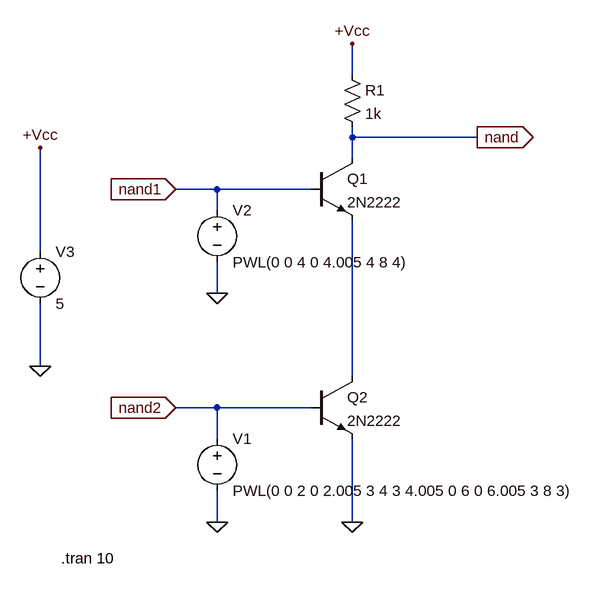
[diagram p0: schematic NAND gate.asc]
NAND gate.asc, the LTspice schematic file:
Version 4
SHEET 1 2492 680
WIRE 416 -176 416 -224
WIRE 416 -80 416 -96
WIRE 608 -80 416 -80
WIRE 416 -48 416 -80
WIRE 208 0 144 0
WIRE 352 0 208 0
WIRE 208 32 208 0
WIRE -64 96 -64 -64
WIRE 208 160 208 112
WIRE -64 272 -64 176
WIRE 416 288 416 48
WIRE 208 336 144 336
WIRE 352 336 208 336
WIRE 208 384 208 336
WIRE 208 512 208 464
WIRE 416 512 416 384
FLAG 208 160 0
FLAG 208 512 0
FLAG 416 512 0
FLAG -64 272 0
FLAG -64 -64 +Vcc
FLAG 416 -224 +Vcc
FLAG 144 0 nand1
IOPIN 144 0 In
FLAG 144 336 nand2
IOPIN 144 336 In
FLAG 608 -80 nand
IOPIN 608 -80 Out
SYMBOL npn 352 -48 R0
SYMATTR InstName Q1
SYMATTR Value 2N2222
SYMBOL npn 352 288 R0
SYMATTR InstName Q2
SYMATTR Value 2N2222
SYMBOL res 400 -192 R0
SYMATTR InstName R1
SYMATTR Value 1k
SYMBOL voltage 208 368 R0
WINDOW 123 0 0 Left 0
WINDOW 39 0 0 Left 0
SYMATTR InstName V1
SYMATTR Value PWL(0 0 2 0 2.005 3 4 3 4.005 0 6 0 6.005 3 8 3)
SYMBOL voltage 208 16 R0
WINDOW 123 0 0 Left 0
WINDOW 39 0 0 Left 0
SYMATTR InstName V2
SYMATTR Value PWL(0 0 4 0 4.005 4 8 4)
SYMBOL voltage -64 80 R0
SYMATTR InstName V3
SYMATTR Value 5
TEXT -32 568 Left 2 !.tran 10

The netlist it stands for:
* NAND gate.asc
Q1 nand nand1 N001 0 2N2222
Q2 N001 nand2 0 0 2N2222
R1 +Vcc nand 1k
V1 nand2 0 PWL(0 0 2 0 2.005 3 4 3 4.005 0 6 0 6.005 3 8 3)
V2 nand1 0 PWL(0 0 4 0 4.005 4 8 4)
V3 +Vcc 0 5
.model NPN NPN
.model PNP PNP
.lib standard.bjt
.tran 10
.backanno
.end